# Altium schematic sheet debugger.SchDoc
size A3; DocumentNumber: 1; Revision: A; SheetNumber: 1; SheetTotal: 1; PageSetup: Record=PageOptions|CenterHorizontal=True|CenterVertical=True|PrintScale=0.71|XCorrection=1.00|YCorrection=1.00|PrintKind=1|BorderSize=5000000|LeftOffset=0|BottomOffset=0|Orientation=2|PaperLength=1000|PaperWidth=1000|Scale=100|PaperSource=268|PrintQuality=-4|MediaType=1|DitherType=10|PaperKind=A4|PrintScaleMode=1; PCB_Name: ICDI
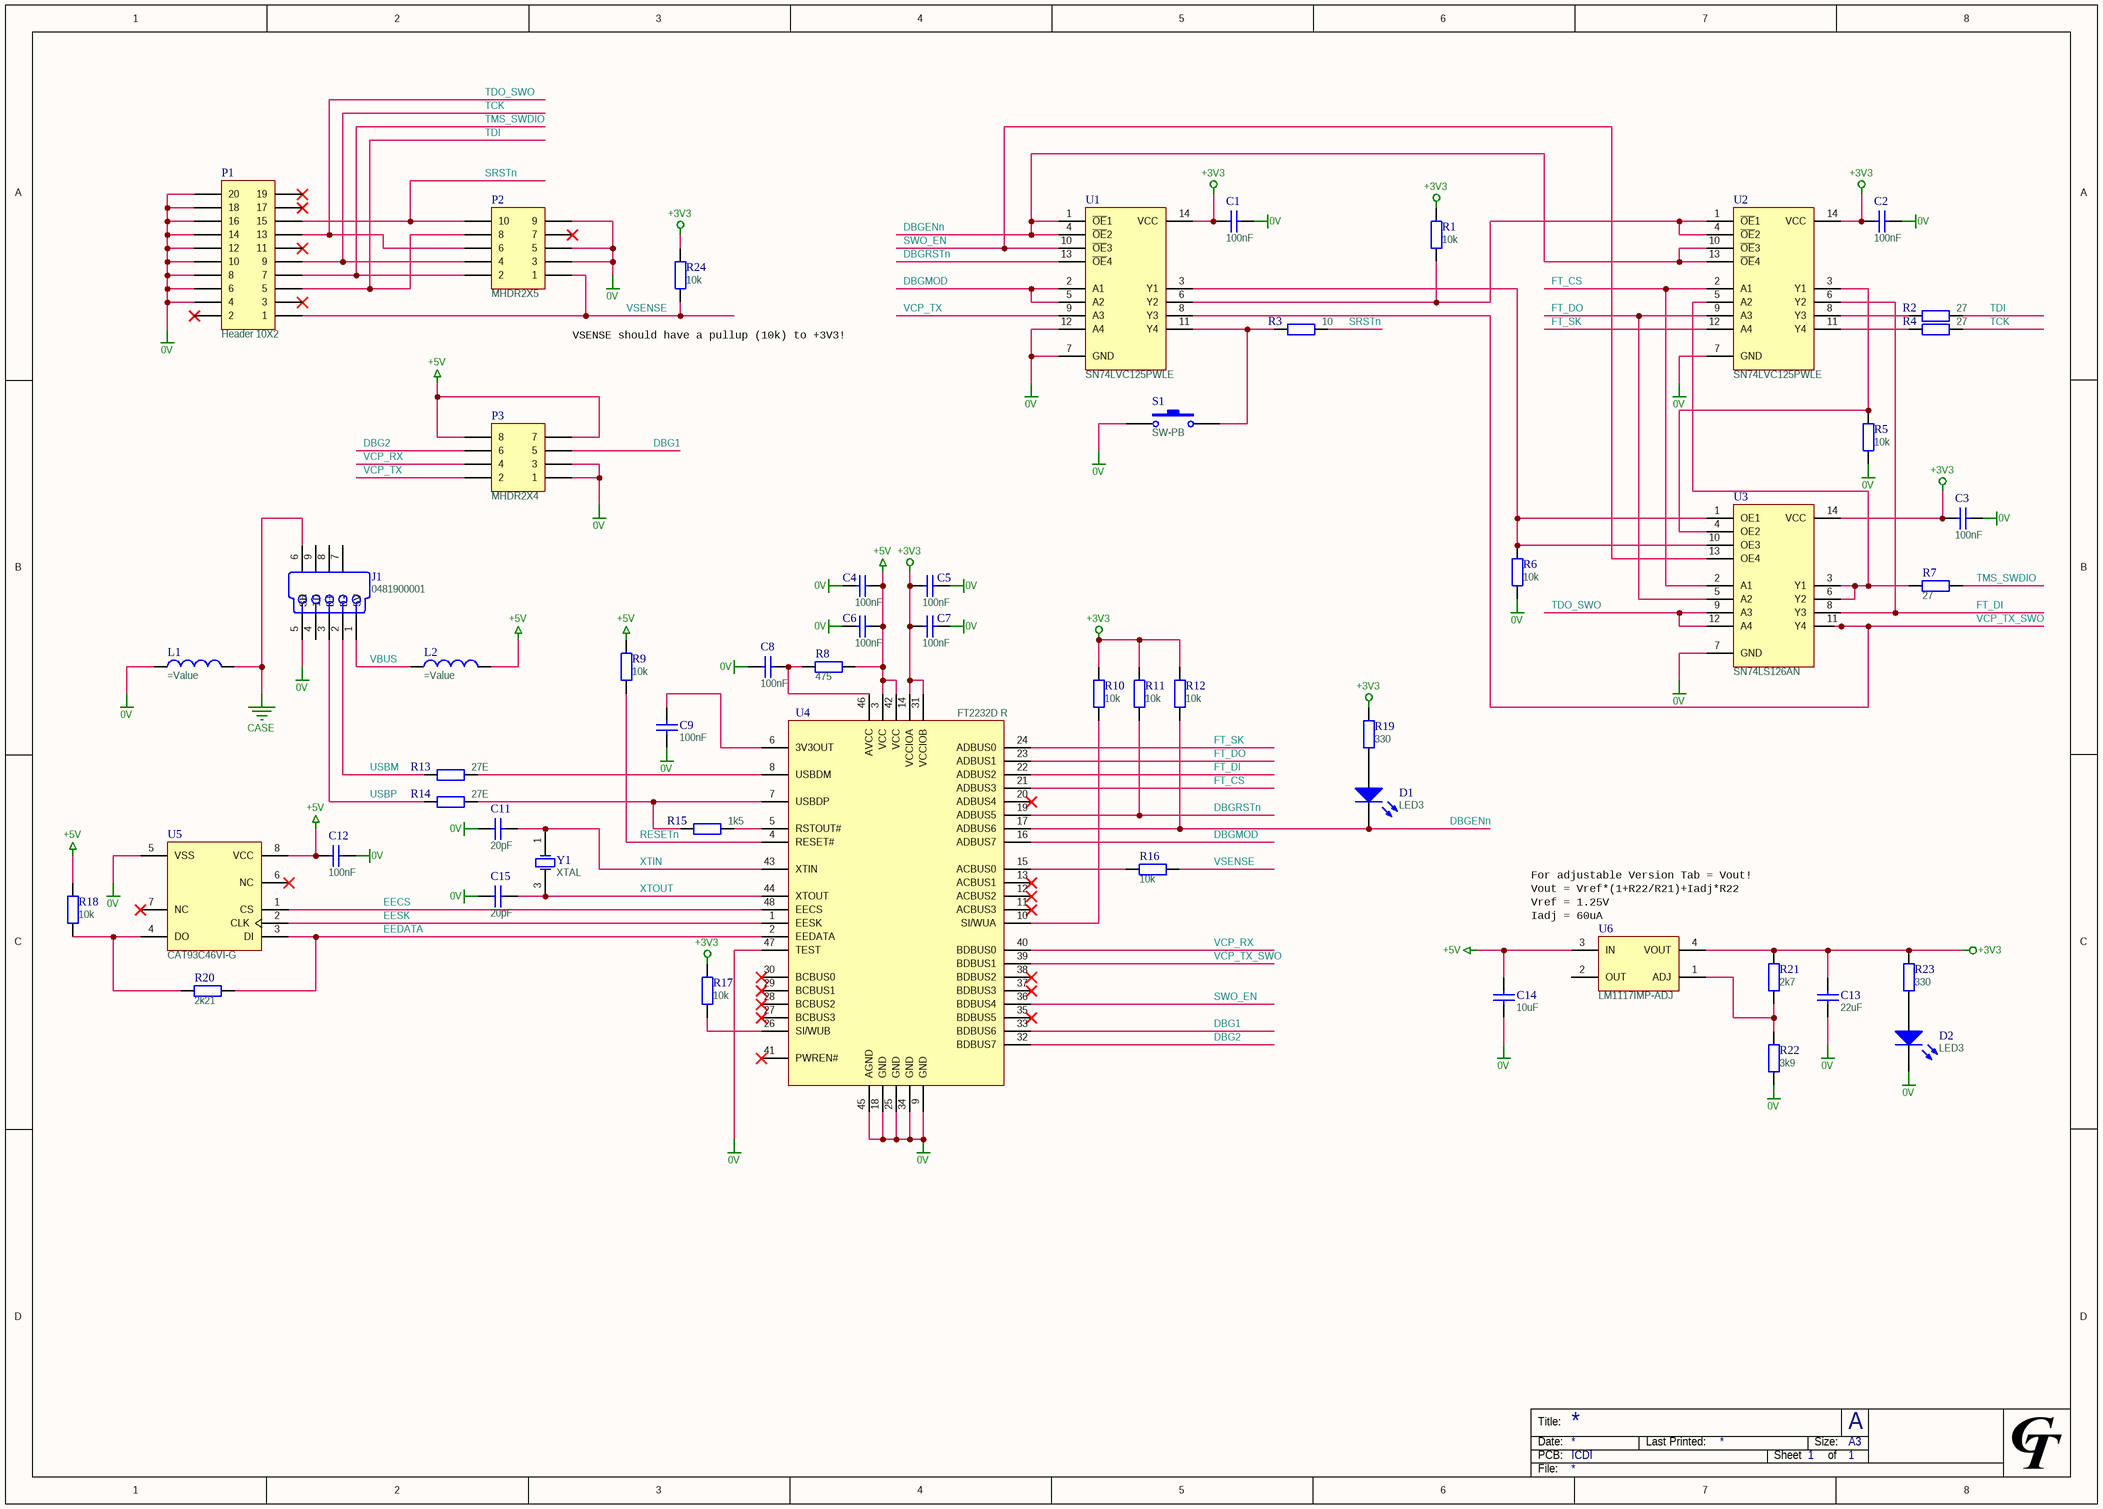
[diagram p0: debugger.SchDoc]

## Parts
C1  100nF  [0603]
C2  100nF  [0603]
C3  100nF  [0603]
C4  100nF  [0603]
C5  100nF  [0603]
C6  100nF  [0603]
C7  100nF  [0603]
C8  100nF  [0603]
C9  100nF  [0603]
C11  20pF  [0603]
C12  100nF  [0603]
C13  22uF  [1210]
C14  10uF  [1210]
C15  20pF  [0603]
D1  LED3  [0805_L]
D2  LED3  [0805_L]
J1  0481900001  [481900001]
L1  (no value)  [0603]
L2  (no value)  [0603]
P1  Header 10X2  [HDR2X10]
P2  MHDR2X5  [MHDR2X5]
P3  MHDR2X4  [MHDR2X4]
R1  10k  [0603]
R2  27  [0603]
R3  10  [0603]
R4  27  [0603]
R5  10k  [0603]
R6  10k  [0603]
R7  27  [0603]
R8  475  [0603]
R9  10k  [0603]
R10  10k  [0603]
R11  10k  [0603]
R12  10k  [0603]
R13  27E  [0603]
R14  27E  [0603]
R15  1k5  [0603]
R16  10k  [0603]
R17  10k  [0603]
R18  10k  [0603]
R19  330  [0603]
R20  2k21  [0603]
R21  2k7  [0603]
R22  3k9  [0603]
R23  330  [0603]
R24  10k  [0603]
S1  SW-PB  [PUSHBTN]
U1  SN74LVC125PWLE  [PW014_N]
U2  SN74LVC125PWLE  [PW014_N]
U3  SN74LS126AN  [PW014_N]
U4  FT2232D R  [LQFP-48_N]
U5  CAT93C46VI-G  [SOIC-SN8_N]
U6  LM1117IMP-ADJ  [MP04A_N]
Y1  XTAL  [xtal]

## Nets
0V: C1.2 C2.2 C3.2 C4.2 C5.2 C6.1 C7.2 C8.1 C9.1 C11.2 C12.2 C13.1 C14.1 C15.2 D2.2(K) J1.5(GND) L1.1 P1.4 P1.6 P1.8 P1.10 P1.12 P1.14 P1.16 P1.18 P1.20 P2.3 P2.5 P2.9 P3.1 P3.3 R5.1 R6.1 R22.1 S1.1 U1.7(GND) U1.12(A4) U2.7(GND) U3.7(GND) U4.9(GND) U4.18(GND) U4.25(GND) U4.34(GND) U4.45(AGND) U4.47(TEST) U5.5(VSS)
+3V3: C1.1 C2.1 C3.1 C5.1 C7.1 C13.2 R1.2 R10.2 R11.2 R12.2 R17.2 R19.1 R21.2 R23.1 R24.2 U1.14(VCC) U2.14(VCC) U3.14(VCC) U4.14(VCCIOA) U4.31(VCCIOB) U6.4(VOUT)
+5V: C4.1 C6.2 C12.1 C14.2 L2.2 P3.7 P3.8 R8.1 R9.2 R18.2 U4.3(VCC) U4.42(VCC) U5.8(VCC) U6.3(IN)
CASE: J1.6(Tab) L1.2
DBG1: P3.5 U4.33(BDBUS6)
DBG2: P3.6 U4.32(BDBUS7)
DBGENn: D1.2(K) R12.1 U1.1(~{OE}1) U1.4(~{OE}2) U2.10(~{OE}3) U2.13(~{OE}4) U4.17(ADBUS6)
DBGMOD: U1.2(A1) U1.5(A2) U4.16(ADBUS7)
DBGRSTn: R11.1 U1.13(~{OE}4) U4.19(ADBUS5)
EECS: U4.48(EECS) U5.1(CS)
EEDATA: R20.2 U4.2(EEDATA) U5.3(DI)
EESK: U4.1(EESK) U5.2(CLK)
FT_CS: U2.2(A1) U3.2(A1) U4.21(ADBUS3)
FT_DI: U2.6(Y2) U3.8(Y3) U4.22(ADBUS2)
FT_DO: U2.9(A3) U3.5(A2) U4.23(ADBUS1)
FT_SK: U2.12(A4) U4.24(ADBUS0)
RESETn: R9.1 U4.4(RESET#)
SRSTn: P1.15 P2.10 R3.2
SWO_EN: U1.10(~{OE}3) U3.13(OE4) U4.36(BDBUS4)
TCK: P1.9 P2.4 R4.2
TDI: P1.5 P2.8 R2.2
TDO_SWO: P1.13 P2.6 U3.9(A3) U3.12(A4)
TMS_SWDIO: P1.7 P2.2 R7.2
USBM: J1.2(D-) R13.1
USBP: J1.3(D+) R14.1
VBUS: J1.1(V_BUS_(5V)) L2.1
VCP_RX: P3.4 U4.40(BDBUS0)
VCP_TX: P3.2 U1.9(A3)
VCP_TX_SWO: U1.8(Y3) U3.11(Y4) U4.39(BDBUS1)
VSENSE: P1.1 P2.1 R16.2 R24.1
XTIN: C11.1 U4.43(XTIN) Y1.1(OSC1)
XTOUT: C15.1 U4.44(XTOUT) Y1.3(OSC2)
NetC8_2: C8.2 R8.2 U4.46(AVCC)
NetC9_2: C9.2 U4.6(3V3OUT)
NetD1_1: D1.1(A) R19.2
NetD2_1: D2.1(A) R23.2
NetR1_1: R1.1 U1.6(Y2) U2.1(~{OE}1) U2.4(~{OE}2)
NetR2_1: R2.1 U2.8(Y3)
NetR3_1: R3.1 S1.2 U1.11(Y4)
NetR4_1: R4.1 U2.11(Y4)
NetR5_2: R5.2 U2.3(Y1) U3.4(OE2)
NetR6_2: R6.2 U1.3(Y1) U3.1(OE1) U3.10(OE3)
NetR7_1: R7.1 U2.5(A2) U3.3(Y1) U3.6(Y2)
NetR10_1: R10.1 U4.10(SI/WUA)
NetR13_2: R13.2 U4.8(USBDM)
NetR14_2: R14.2 R15.1 U4.7(USBDP)
NetR15_2: R15.2 U4.5(RSTOUT#)
NetR16_1: R16.1 U4.15(ACBUS0)
NetR17_1: R17.1 U4.26(SI/WUB)
NetR18_1: R18.1 R20.1 U5.4(DO)
NetR21_1: R21.1 R22.2 U6.1(ADJ)

Not connected (* = marked no-connect by the designer): J1 4(NC) 7(Tab) 8(Tab) 9(Tab); P1 2* 3* 11* 17* 19*; P2 7*; U4 11(ACBUS3)* 12(ACBUS2)* 13(ACBUS1)* 20(ADBUS4)* 27(BCBUS3)* 28(BCBUS2)* 29(BCBUS1)* 30(BCBUS0)* 35(BDBUS5)* 37(BDBUS3)* 38(BDBUS2)* 41(PWREN#)*; U5 6(NC)* 7(NC)*; U6 2(OUT)

## Notes on the sheet
- VSENSE should have a pullup (10k) to +3V3!
- Vout = Vref*(1+R22/R21)+Iadj*R22
- (near U6) Vref = 1.25V
- (near U6) Iadj = 60uA
- For adjustable Version Tab = Vout!
- Title:
- Date:
- PCB:
- Last Printed:
- Sheet
- Size:
- of
- A3
- File:
- (in symbol 0481900001) SH; ID; 5V

## Library data of the parts
C1-C9 C11-C15 = Cap: Capacitor
  C1-C9 C12: Value: 100nF
  C11 C15: Value: 20pF
  C13: Value: 22uF
  C14: Value: 10uF
D1 D2 = LED3: Typical BLUE SiC LED; Manufacturer: ROHM; Order Code: 1685056; Supplier: Farnell; Price (CHF): 0.97
J1 = 0481900001: USB On-The-Go (OTG) Mini-B Receptacle, Right Angle, SMT, 0.80mm (.031") Pitch, Solder Tabs with Back Cover, Recessed Type; Manufacturer: Hirose; Order Code: 327 584-0; Supplier: Compona; Price (CHF): 2.14
L1 L2 = Inductor: Manufacturer: PANASONIC; Order Code: 1292698; Price (CHF): 0.345; Supplier: Farnell
P1 = Header 10X2: Header, 10-Pin, Dual row; Manufacturer: FCI; Order Code: 247 678-6; Supplier: Compona; Price (CHF): 0.89
P2 = MHDR2X5: Header, 5-Pin, Dual row; Manufacturer: MULTICOMP; Order Code: 1577747; Supplier: Farnell; Price (CHF): 1.45
P3 = MHDR2X4: Header, 4-Pin, Dual row; Manufacturer: MULTICOMP; Order Code: 1577749; Supplier: Farnell; Price (CHF): 2.45
R1-R24 = Res2: Resistor
  R1 R5 R6 R9-R12 R16-R18 R24: Value: 10k
  R2 R4 R7: Value: 27
  R3: Value: 10
  R8: Value: 475
  R13 R14: Value: 27E
  R15: Value: 1k5
  R19 R23: Value: 330
  R20: Value: 2k21
  R21: Value: 2k7
  R22: Value: 3k9
S1 = SW-PB: Switch
U1 U2 = SN74LVC125PWLE: Quadruple Bus Buffer Gate with 3-State Outputs; Manufacturer: TEXAS INSTRUMENTS; Order Code: 1102981; Supplier: Farnell; Price (CHF): 0.82
U3 = SN74LS126AN: Quadruple Bus Buffer with 3-State Outputs; Manufacturer: TEXAS INSTRUMENTS; Order Code: 1287585; Supplier: Farnell; Price (CHF): 0.7
U4 = FT2232C: Dual USB UART/FIFO Chip, LQFP-48; Manufacturer: FTDI; Order Code: 768-1010-1-ND; Supplier: DigiKey; Price (CHF): 7.6
U5 = 93C46B-I/SN: 1K, 64xEEPROM, 1K, 64X16, MICROWIRE, SOIC8; Manufacturer: CATALYST SEMICONDUCTOR; Order Code: 1631146; Supplier: Farnell; Price (CHF): 0.551
U6 = LM1117IMP-ADJ: 800mA Low-Dropout Linear Regulator; Manufacturer: NATIONAL SEMICONDUCTOR; Order Code: 1469050; Supplier: Farnell; Price (CHF): 1.95
Y1 = XTAL: Crystal Oscillator; Manufacturer: SIWARD; Order Code: 741 288-1; Supplier: Compona; Price (CHF): 1.30